# EAGLE schematic f91_display_connector (EAGLE 7.5.0)
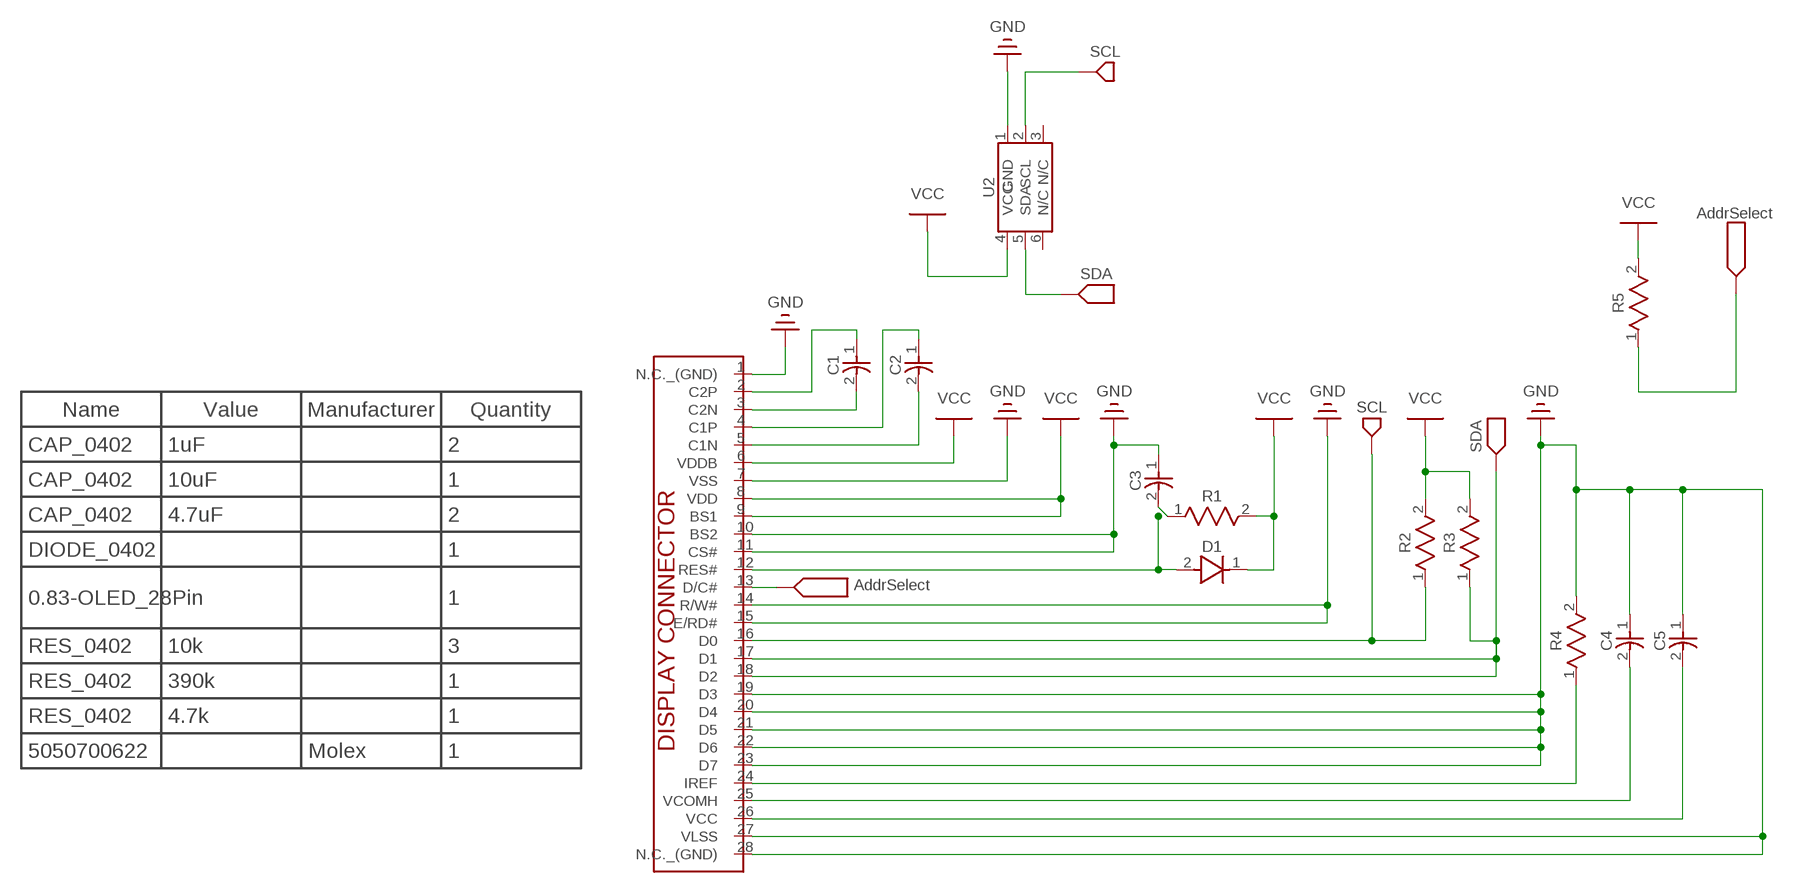
[diagram p0: schematic, sheet 1]

## Parts
C1  1uF  CAP_0402  [CAP_0402]
C2  1uF  CAP_0402  [CAP_0402]
C3  10uF  CAP_0402  [CAP_0402]
C4  4.7uF  CAP_0402  [CAP_0402]
C5  4.7uF  CAP_0402  [CAP_0402]
D1  DIODE_0402  [DIO_0402]
Display_Connector  0.83-OLED_28PIN  [0.83-OLED_28PIN]
R1  10k  RES_0402  [RES_0402]
R2  10k  RES_0402  [RES_0402]
R3  10k  RES_0402  [RES_0402]
R4  390k  RES_0402  [RES_0402]
R5  4.7k  RES_0402  [RES_0402]
U2  5050700622  [5050700622]

## Nets
Net_0: C3.1 C4.1 C5.1 Display_Connector.1(N.C._(GND)) Display_Connector.7(VSS) Display_Connector.10(BS2) Display_Connector.11(CS#) Display_Connector.14(R/W#) Display_Connector.15(E/RD#) Display_Connector.19(D3) Display_Connector.20(D4) Display_Connector.21(D5) Display_Connector.22(D6) Display_Connector.23(D7) Display_Connector.27(VLSS) Display_Connector.28(N.C._(GND)) R4.2 U2.1(GND) ; supply symbol labelled GND
Net_1: C1.1 Display_Connector.2(C2P)
Net_2: C1.2 Display_Connector.3(C2N)
Net_3: C2.1 Display_Connector.4(C1P)
Net_4: C2.2 Display_Connector.5(C1N)
Net_5: D1.1(K) Display_Connector.6(VDDB) Display_Connector.8(VDD) Display_Connector.9(BS1) R1.2 R2.2 R3.2 R5.2 U2.4(VCC) ; supply symbol labelled VCC
Net_6: C3.2 D1.2(A) Display_Connector.12(RES#) R1.1
Net_7: Display_Connector.16(D0) R2.1 U2.2(SCL) ; supply symbol labelled SCL
Net_8: Display_Connector.17(D1) Display_Connector.18(D2) R3.1 U2.5(SDA) ; supply symbol labelled SDA
Net_9: Display_Connector.24(IREF) R4.1
Net_10: C4.2 Display_Connector.25(VCOMH)
Net_11: C5.2 Display_Connector.26(VCC)
Net_13: Display_Connector.13(D/C#) R5.1 ; supply symbol labelled AddrSelect
Unconnected: U2.3(N/C) U2.6(N/C)

## Notes on the sheet
- Name | Value | Manufacturer | Quantity
- CAP_0402 | 1uF | 2
- CAP_0402 | 10uF | 1
- CAP_0402 | 4.7uF | 2
- DIODE_0402 | 1
- 0.83-OLED_28Pin | 1
- RES_0402 | 10k | 3
- RES_0402 | 390k | 1
- RES_0402 | 4.7k | 1
- 5050700622 | Molex | 1

## Library data of the parts
C1 C2 = common:CAP_0402
C3-C5 = common:CAP_0402; VALUE: 1uF
D1 = common:DIODE_0402
Display_Connector = common:0.83-OLED_28PIN
R1-R3 = common:RES_0402
R4 R5 = common:RES_0402; VALUE: 10k
U2 = common:5050700622; MANUFACTURER: Molex